# EAGLE design Rover Sensors Shield (EAGLE 9.4.2)
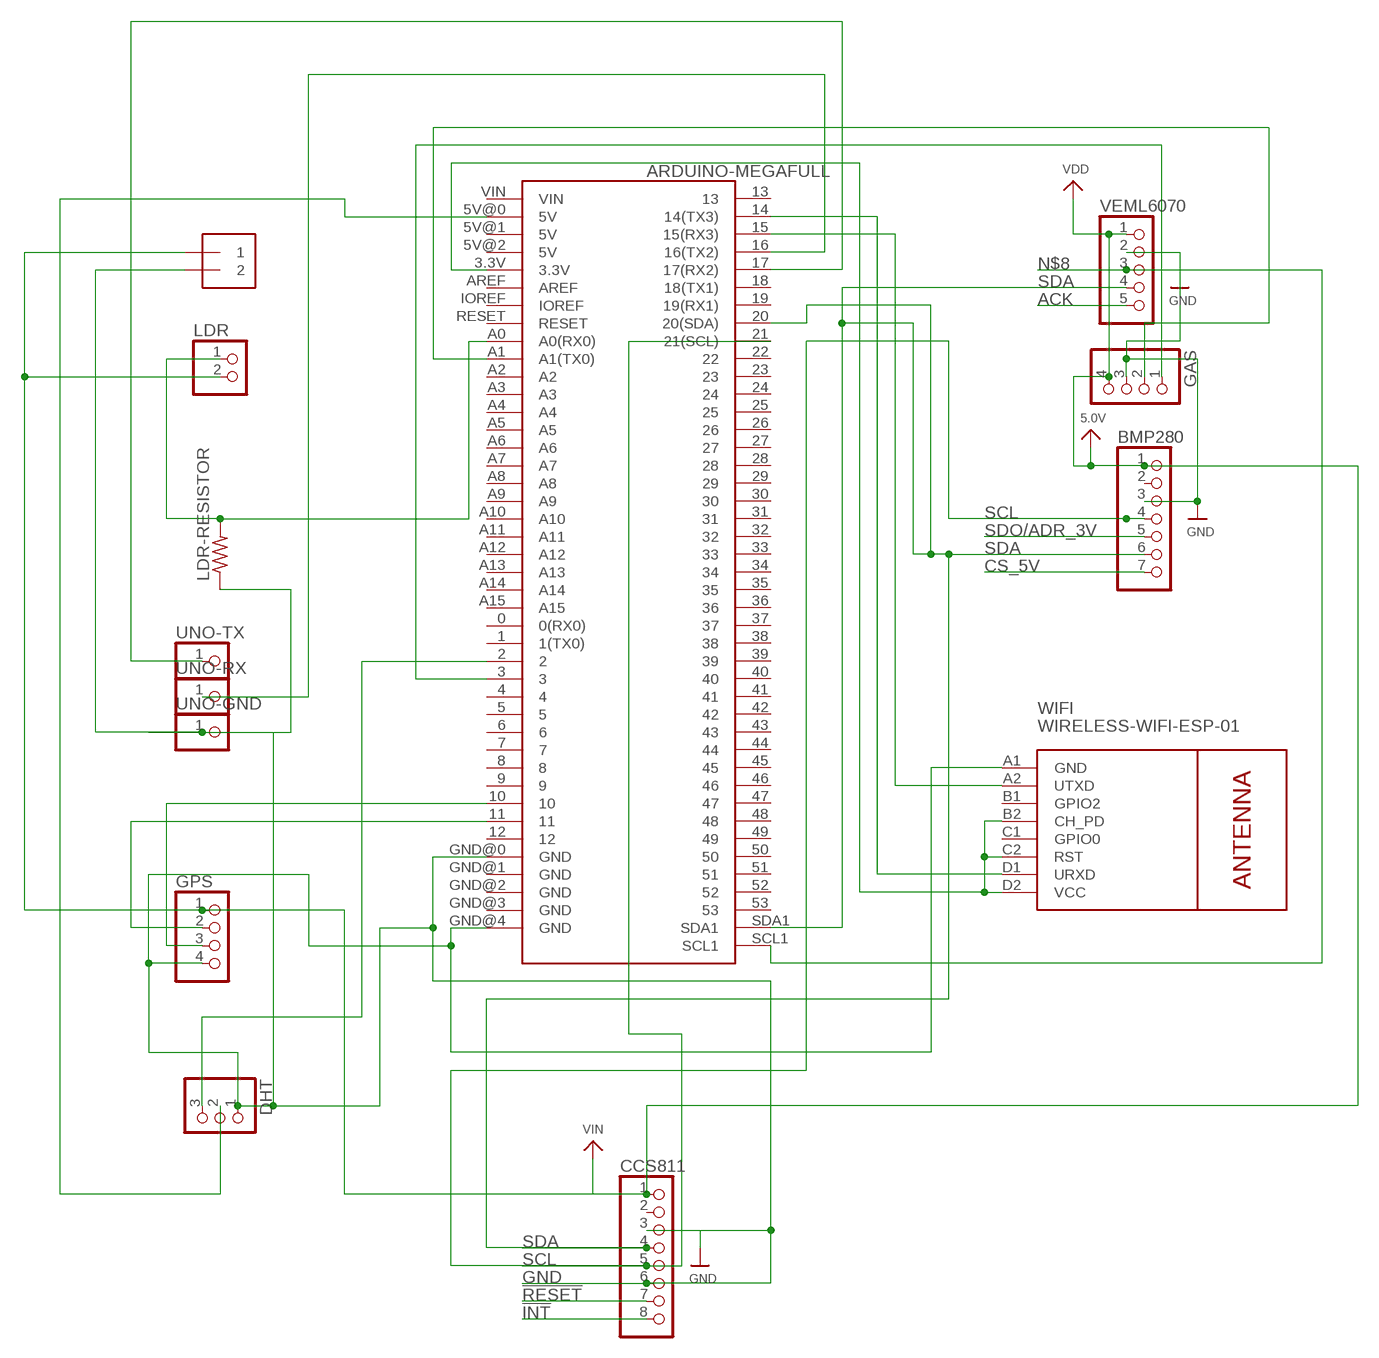
[diagram p0: schematic, sheet 1]

## Parts
BATTERY  1X2-3.5MM  [1X2-3.5MM]
BMP280  HEADER-1X770MIL  [1X07_ROUND_70]
CCS811  HEADER-1X870MIL  [1X08_ROUND_70]
DHT  PINHD-1X3  [1X03]
GAS  PINHD-1X4  [1X04]
GPS  PINHD-1X4  [1X04]
LDR  PINHD-1X2  [1X02]
LDR-RESISTOR  R-US_0204/7  [0204/7]
U2  ARDUINO-MEGAFULL  [ARDUINO_MEGA]
UNO-GND  PINHD-1X1  [1X01]
UNO-RX  PINHD-1X1  [1X01]
UNO-TX  PINHD-1X1  [1X01]
VEML6070  HEADER-1X570MIL  [1X05_ROUND_70]
WIFI  WIRELESS-WIFI-ESP-01  [WIRELESS-WIFI-ESP-01]

## Nets
!INT: CCS811.8
!RESET: CCS811.7
ACK: VEML6070.5
CS_5V: BMP280.7
GND: BATTERY.2 BMP280.3 CCS811.3 CCS811.6 DHT.1 GAS.3 GPS.4 LDR-RESISTOR.1 U2.GND@0(GND) U2.GND@4(GND) UNO-GND.1 VEML6070.2 WIFI.A1(GND)
N$1: GAS.2 U2.A1(A1(TX0))
N$2: GAS.1 U2.3
N$3: U2.3.3V WIFI.B2(CH_PD) WIFI.C2(RST) WIFI.D2(VCC)
N$4: U2.14(14(TX3)) WIFI.D1(URXD)
N$5: U2.15(15(RX3)) WIFI.A2(UTXD)
N$6: DHT.2 U2.5V@0(5V)
N$7: DHT.3 U2.2
N$8: U2.SCL1 VEML6070.3
N$10: GPS.3 U2.10
N$11: GPS.2 U2.11
N$12: U2.16(16(TX2)) UNO-RX.1
N$13: U2.17(17(RX2)) UNO-TX.1
N$14: LDR-RESISTOR.2 LDR.1 U2.A0(A0(RX0))
SCL: BMP280.4 CCS811.5 U2.21(21(SCL))
SDA: BMP280.6 CCS811.4 U2.20(20(SDA)) U2.SDA1 VEML6070.4
SDO/ADR_3V: BMP280.5
VDD: BATTERY.1 BMP280.1 CCS811.1 GAS.4 GPS.1 LDR.2 VEML6070.1 ; supply symbol labelled 5.0V, VIN
Unconnected: BMP280.2 CCS811.2 U2.0(0(RX0)) U2.1(1(TX0)) U2.4 U2.5 U2.5V@1(5V) U2.5V@2(5V) U2.6 U2.7 U2.8 U2.9 U2.12 U2.13 U2.18(18(TX1)) U2.19(19(RX1)) U2.22 U2.23 U2.24 U2.25 U2.26 U2.27 U2.28 U2.29 U2.30 U2.31 U2.32 U2.33 U2.34 U2.35 U2.36 U2.37 U2.38 U2.39 U2.40 U2.41 U2.42 U2.43 U2.44 U2.45 U2.46 U2.47 U2.48 U2.49 U2.50 U2.51 U2.52 U2.53 U2.A2 U2.A3 U2.A4 U2.A5 U2.A6 U2.A7 U2.A8 U2.A9 U2.A10 U2.A11 U2.A12 U2.A13 U2.A14 U2.A15 U2.AREF U2.GND@1(GND) U2.GND@2(GND) U2.GND@3(GND) U2.IOREF U2.RESET U2.VIN WIFI.B1(GPIO2) WIFI.C1(GPIO0)

## Library data of the parts
BATTERY = adafruit:1X2: 3.5mm Terminal block http://www.ladyada.net/library/pcb/eaglelibrary.html
BMP280 = microbuilder:HEADER-1X7: PIN HEADER
CCS811 = microbuilder:HEADER-1X8: PIN HEADER
DHT = pinhead:PINHD-1X3: PIN HEADER
GAS GPS = pinhead:PINHD-1X4: PIN HEADER
LDR = pinhead:PINHD-1X2: PIN HEADER
LDR-RESISTOR = adafruit:R-US_: RESISTOR, American symbol
U2 = zortness:ARDUINO-MEGA: Arduino MegaR3 board footprint. Also works for Due.
UNO-GND UNO-RX UNO-TX = pinhead:PINHD-1X1: PIN HEADER
VEML6070 = microbuilder:HEADER-1X5: PIN HEADER
WIFI = diy-modules:WIRELESS-WIFI-ESP-01: Wireless Wi-Fi ESP-01 Module based on ESP8266 chip Click here to find device on ebay.com <http://www.ebay.com/sch/esp8266+esp+01+transceiver>

## Board
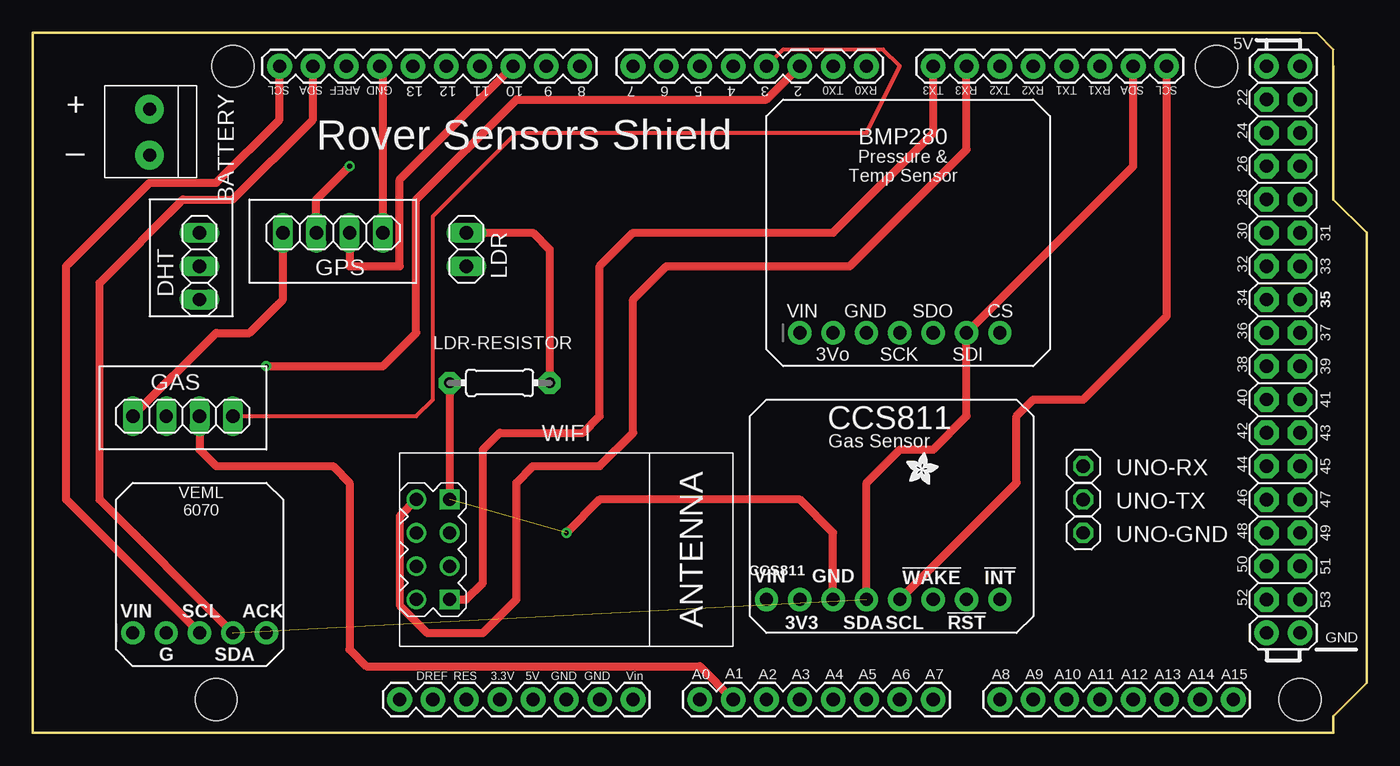
[diagram p1: board, top side]
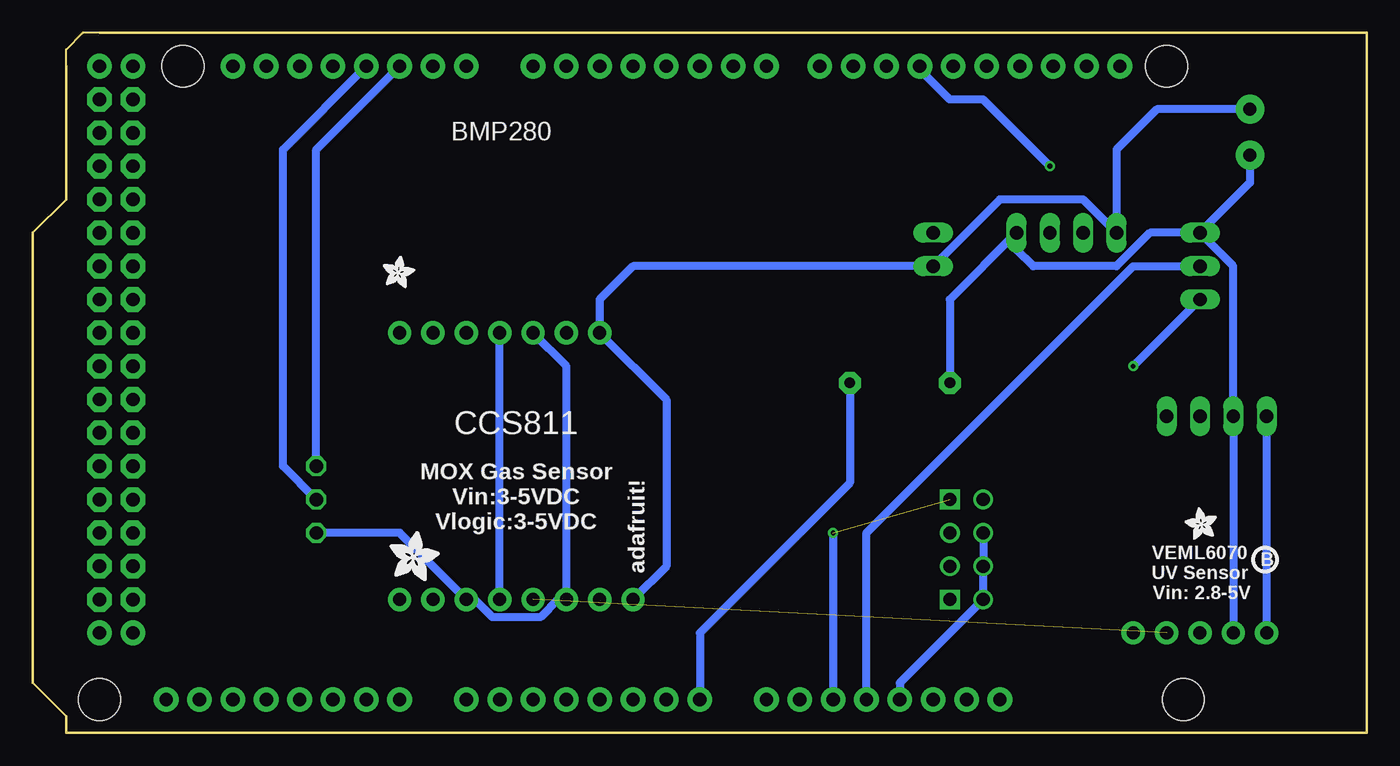
[diagram p2: board, bottom side, seen from below]

Size 101.6 x 53.34 mm. Coordinates in mm from the lower left corner, seen from the top.
Copper layers (1*16): Top 0.035mm / dielectric 1.5mm / Bottom 0.035mm
Design rules "default": minimum track width 6mil, minimum drill 0.35mm, track to track 6mil, track to pad 6mil, pad to pad 6mil, via to via 6mil, smd to smd 6mil, copper to edge 40mil, drill to drill 6mil, minimum pad ring 10mil, minimum via ring 8mil, stop-mask expansion 4mil, vias tented up to drill 0mil, thermal gap 10mil

### Footprints (pad centres in the part's own frame; a part is rotated, then mirrored left to right if it is on the bottom)
1X2-3.5MM = drill 1 pad 2.184: 1 1.8,0; 2 -1.7,0
1X07_ROUND_70 = drill 1 pad 1.778: 1 -7.62,0; 2 -5.08,0; 3 -2.54,0; 4 0,0; 5 2.54,0; 6 5.08,0; 7 7.62,0
1X08_ROUND_70 = drill 1 pad 1.778: 1 -8.89,0; 2 -6.35,0; 3 -3.81,0; 4 -1.27,0; 5 1.27,0; 6 3.81,0; 7 6.35,0; 8 8.89,0
1X03 = drill 1.016 long: 1 -2.54,0; 2 0,0; 3 2.54,0
1X04 = drill 1.016 long: 1 -3.81,0; 2 -1.27,0; 3 1.27,0; 4 3.81,0
1X02 = drill 1.016 long: 1 -1.27,0; 2 1.27,0
0204/7 = drill 0.813 pad 1.676 octagon: 1 -3.81,0; 2 3.81,0
ARDUINO_MEGA = drill 1.016 pad 1.88: 0 63.5,50.8; 1 60.96,50.8; 2 58.42,50.8; 3 55.88,50.8; 3.3V 35.56,2.54; 4 53.34,50.8; 5 50.8,50.8; 5V@0 38.1,2.54; 5V@1 93.98,50.8; 5V@2 96.52,50.8; 6 48.26,50.8; 7 45.72,50.8; 8 41.656,50.8; 9 39.116,50.8; 10 36.576,50.8; 11 34.036,50.8; 12 31.496,50.8; 13 28.956,50.8; 14 68.58,50.8; 15 71.12,50.8; 16 73.66,50.8; 17 76.2,50.8; 18 78.74,50.8; 19 81.28,50.8; 20 83.82,50.8; 21 86.36,50.8; A0 50.8,2.54; A1 53.34,2.54; A2 55.88,2.54; A3 58.42,2.54; A4 60.96,2.54; A5 63.5,2.54; A6 66.04,2.54; A7 68.58,2.54; A8 73.66,2.54; A9 76.2,2.54; A10 78.74,2.54; A11 81.28,2.54; A12 83.82,2.54; A13 86.36,2.54; A14 88.9,2.54; A15 91.44,2.54; AREF 23.876,50.8; EMPTY 27.94,2.54; GND@0 40.64,2.54; GND@1 43.18,2.54; GND@2 93.98,7.62; GND@3 96.52,7.62; GND@4 26.416,50.8; IOREF 30.48,2.54; RESET 33.02,2.54; SCL1 18.796,50.8; SDA1 21.336,50.8; VIN 45.72,2.54 | drill 1.016 pad 1.88 octagon: 22 93.98,48.26; 23 96.52,48.26; 24 93.98,45.72; 25 96.52,45.72; 26 93.98,43.18; 27 96.52,43.18; 28 93.98,40.64; 29 96.52,40.64; 30 93.98,38.1; 31 96.52,38.1; 32 93.98,35.56; 33 96.52,35.56; 34 93.98,33.02; 35 96.52,33.02; 36 93.98,30.48; 37 96.52,30.48; 38 93.98,27.94; 39 96.52,27.94; 40 93.98,25.4; 41 96.52,25.4; 42 93.98,22.86; 43 96.52,22.86; 44 93.98,20.32; 45 96.52,20.32; 46 93.98,17.78; 47 96.52,17.78; 48 93.98,15.24; 49 96.52,15.24; 50 93.98,12.7; 51 96.52,12.7; 52 93.98,10.16; 53 96.52,10.16 | hole 3.2: 15.24,50.8; 13.97,2.54; 90.17,50.8; 96.52,2.54
1X01 = drill 1.016 octagon: 1 0,0
1X05_ROUND_70 = drill 1 pad 1.778: 1 -5.08,0; 2 -2.54,0; 3 0,0; 4 2.54,0; 5 5.08,0
WIRELESS-WIFI-ESP-01 = drill 1 square: A1 -8.89,3.81; D1 -8.89,-3.81 | drill 1: A2 -11.43,3.81; B1 -8.89,1.27; B2 -11.43,1.27; C1 -8.89,-1.27; C2 -11.43,-1.27; D2 -11.43,-3.81

### Placement (x,y rotation side)
BATTERY  8.89,45.72 90 top
BMP280  66.04,30.48 0 top
CCS811  64.77,10.16 0 top
DHT  12.7,35.56 270 top
GAS  11.43,24.13 180 top
GPS  22.86,38.1 0 top
LDR  33.02,36.83 270 top
LDR-RESISTOR  35.56,26.67 0 top
U2  0,0 0 top
U$11  [ADAFRUIT_2.5MM]  11.43,14.73 90 bottom
U$14  [ADAFRUIT_2.5MM]  74.93,33.91 0 bottom
U$15  [PCBFEAT-REV-040]  7.75,13.21 0 bottom
U$18  [ADAFRUIT_2.5MM]  66.55,18.92 0 top
U$20  [ADAFRUIT_3.5MM]  74.42,11.56 0 bottom
UNO-GND  80.01,15.24 0 top
UNO-RX  80.01,20.32 0 top
UNO-TX  80.01,17.78 0 top
VEML6070  12.7,7.62 0 top
WIFI  40.64,13.97 0 top

### Tracks (layer width: path | path; a pad name or v marks a point on that pad's centre or on a via)
GND  (via drill 0.35)  (1 unrouted)
  Top 0.61: LDR-RESISTOR.1 WIFI.A1 | CCS811.3 60.96,15.24 58.42,17.78 43.18,17.78 v40.64,15.24 | GPS.4 26.67,50.55 U2.GND@4
  Bottom 0.61: v40.64,15.24 U2.GND@0 | VEML6070.2 GAS.3 10.16,35.56 DHT.1 | BATTERY.2 8.89,41.91 DHT.1 | DHT.1 16.51,38.1 19.05,35.56 25.4,35.56 26.67,36.83 GPS.4 31.75,33.02 LDR-RESISTOR.1 | BMP280.3 60.96,27.94 CCS811.3 61.6,10.16 62.94,8.81 66.6,8.81 67.94,10.16 CCS811.6 73.66,15.24 UNO-GND.1
N$1
  Top 0.61: GAS.2 12.7,21.59 13.97,20.32 22.86,20.32 24.13,19.05 24.13,6.35 25.4,5.08 50.8,5.08 U2.A1
N$2
  Top 0.305: GAS.1 29.21,24.13 30.48,25.4 30.48,39.37 36.83,45.72 63.5,45.72 66.04,50.8 64.77,52.07 57.15,52.07 U2.3
N$3
  Bottom 0.61: WIFI.B2 WIFI.C2 WIFI.D2 35.56,3.81 U2.3.3V
N$4
  Top 0.61: WIFI.D1 33.02,10.16 34.29,11.43 34.29,21.59 35.56,22.86 41.91,22.86 43.18,24.13 43.18,35.56 45.72,38.1 60.96,38.1 68.58,45.72 U2.14
N$5
  Top 0.61: WIFI.A2 27.94,16.51 27.94,9.72 30.04,7.62 34.29,7.62 36.83,10.16 36.83,19.05 38.1,20.32 43.18,20.32 45.72,22.86 45.72,33.02 48.26,35.56 62.23,35.56 71.12,44.45 U2.15
N$6
  Bottom 0.61: U2.5V@0 38.1,15.24 17.78,35.56 DHT.2
N$7  (via drill 0.35)
  Top 0.61: v17.78,27.94 26.67,27.94 29.21,30.48 29.21,40.64 36.83,48.26 55.88,48.26 U2.2
  Bottom 0.61: DHT.3 v17.78,27.94
N$8
  Top 0.61: VEML6070.3 2.54,17.78 2.54,35.56 8.89,41.91 13.97,41.91 18.8,46.74 U2.SCL1
N$10
  Top 0.61: GPS.3 24.13,35.56 27.94,35.56 27.94,42.16 U2.10
N$11  (via drill 0.35)
  Top 0.61: GPS.2 21.59,40.64 v24.13,43.18
  Bottom 0.61: v24.13,43.18 29.21,48.26 31.75,48.26 34.04,50.55 U2.11
N$12
  Bottom 0.61: UNO-RX.1 80.01,44.45 U2.16
N$13
  Bottom 0.61: UNO-TX.1 82.55,20.32 82.55,44.45 U2.17
N$14
  Top 0.61: LDR.1 38.1,38.1 39.37,36.83 LDR-RESISTOR.2
  Bottom 0.61: LDR-RESISTOR.2 39.37,19.05 50.8,7.62 U2.A0
SCL
  Top 0.61: CCS811.5 74.93,19.05 74.93,24.13 76.2,25.4 80.01,25.4 86.36,31.75 U2.21
  Bottom 0.61: CCS811.5 BMP280.4
SDA  (1 unrouted)
  Top 0.61: VEML6070.4 5.08,17.78 5.08,34.29 11.43,40.64 15.24,40.64 21.34,46.74 U2.SDA1 | CCS811.4 63.5,19.05 66.04,21.59 68.58,21.59 71.12,24.13 BMP280.6 83.82,43.18 U2.20
VDD
  Top 0.61: GAS.4 13.97,30.48 16.51,30.48 19.05,33.02 GPS.1
  Bottom 0.61: VEML6070.1 GAS.4 | BATTERY.1 15.98,47.52 19.05,44.45 GPS.1 21.59,40.64 27.94,40.64 LDR.2 55.88,35.56 58.42,33.02 BMP280.1 53.34,25.4 53.34,12.7 CCS811.1

### Text on the board
tPlace: + | _ | Rover Sensors Shield | BMP280 | Pressure & / Temp Sensor | VIN | GND | SDO | CS | 3Vo | SCK | SDI | CCS811 | Gas Sensor | VEML / 6070 | VIN | GND | !WAKE | !INT | VIN | SCL | ACK | 3V3 | SDA | SCL | !RST | G | SDA
bPlace: BMP280 | CCS811 | MOX Gas Sensor / Vin:3-5VDC / Vlogic:3-5VDC | adafruit! | VEML6070 / UV Sensor | Vin: 2.8-5V